# Altium project Buck_Boost.PrjPcb
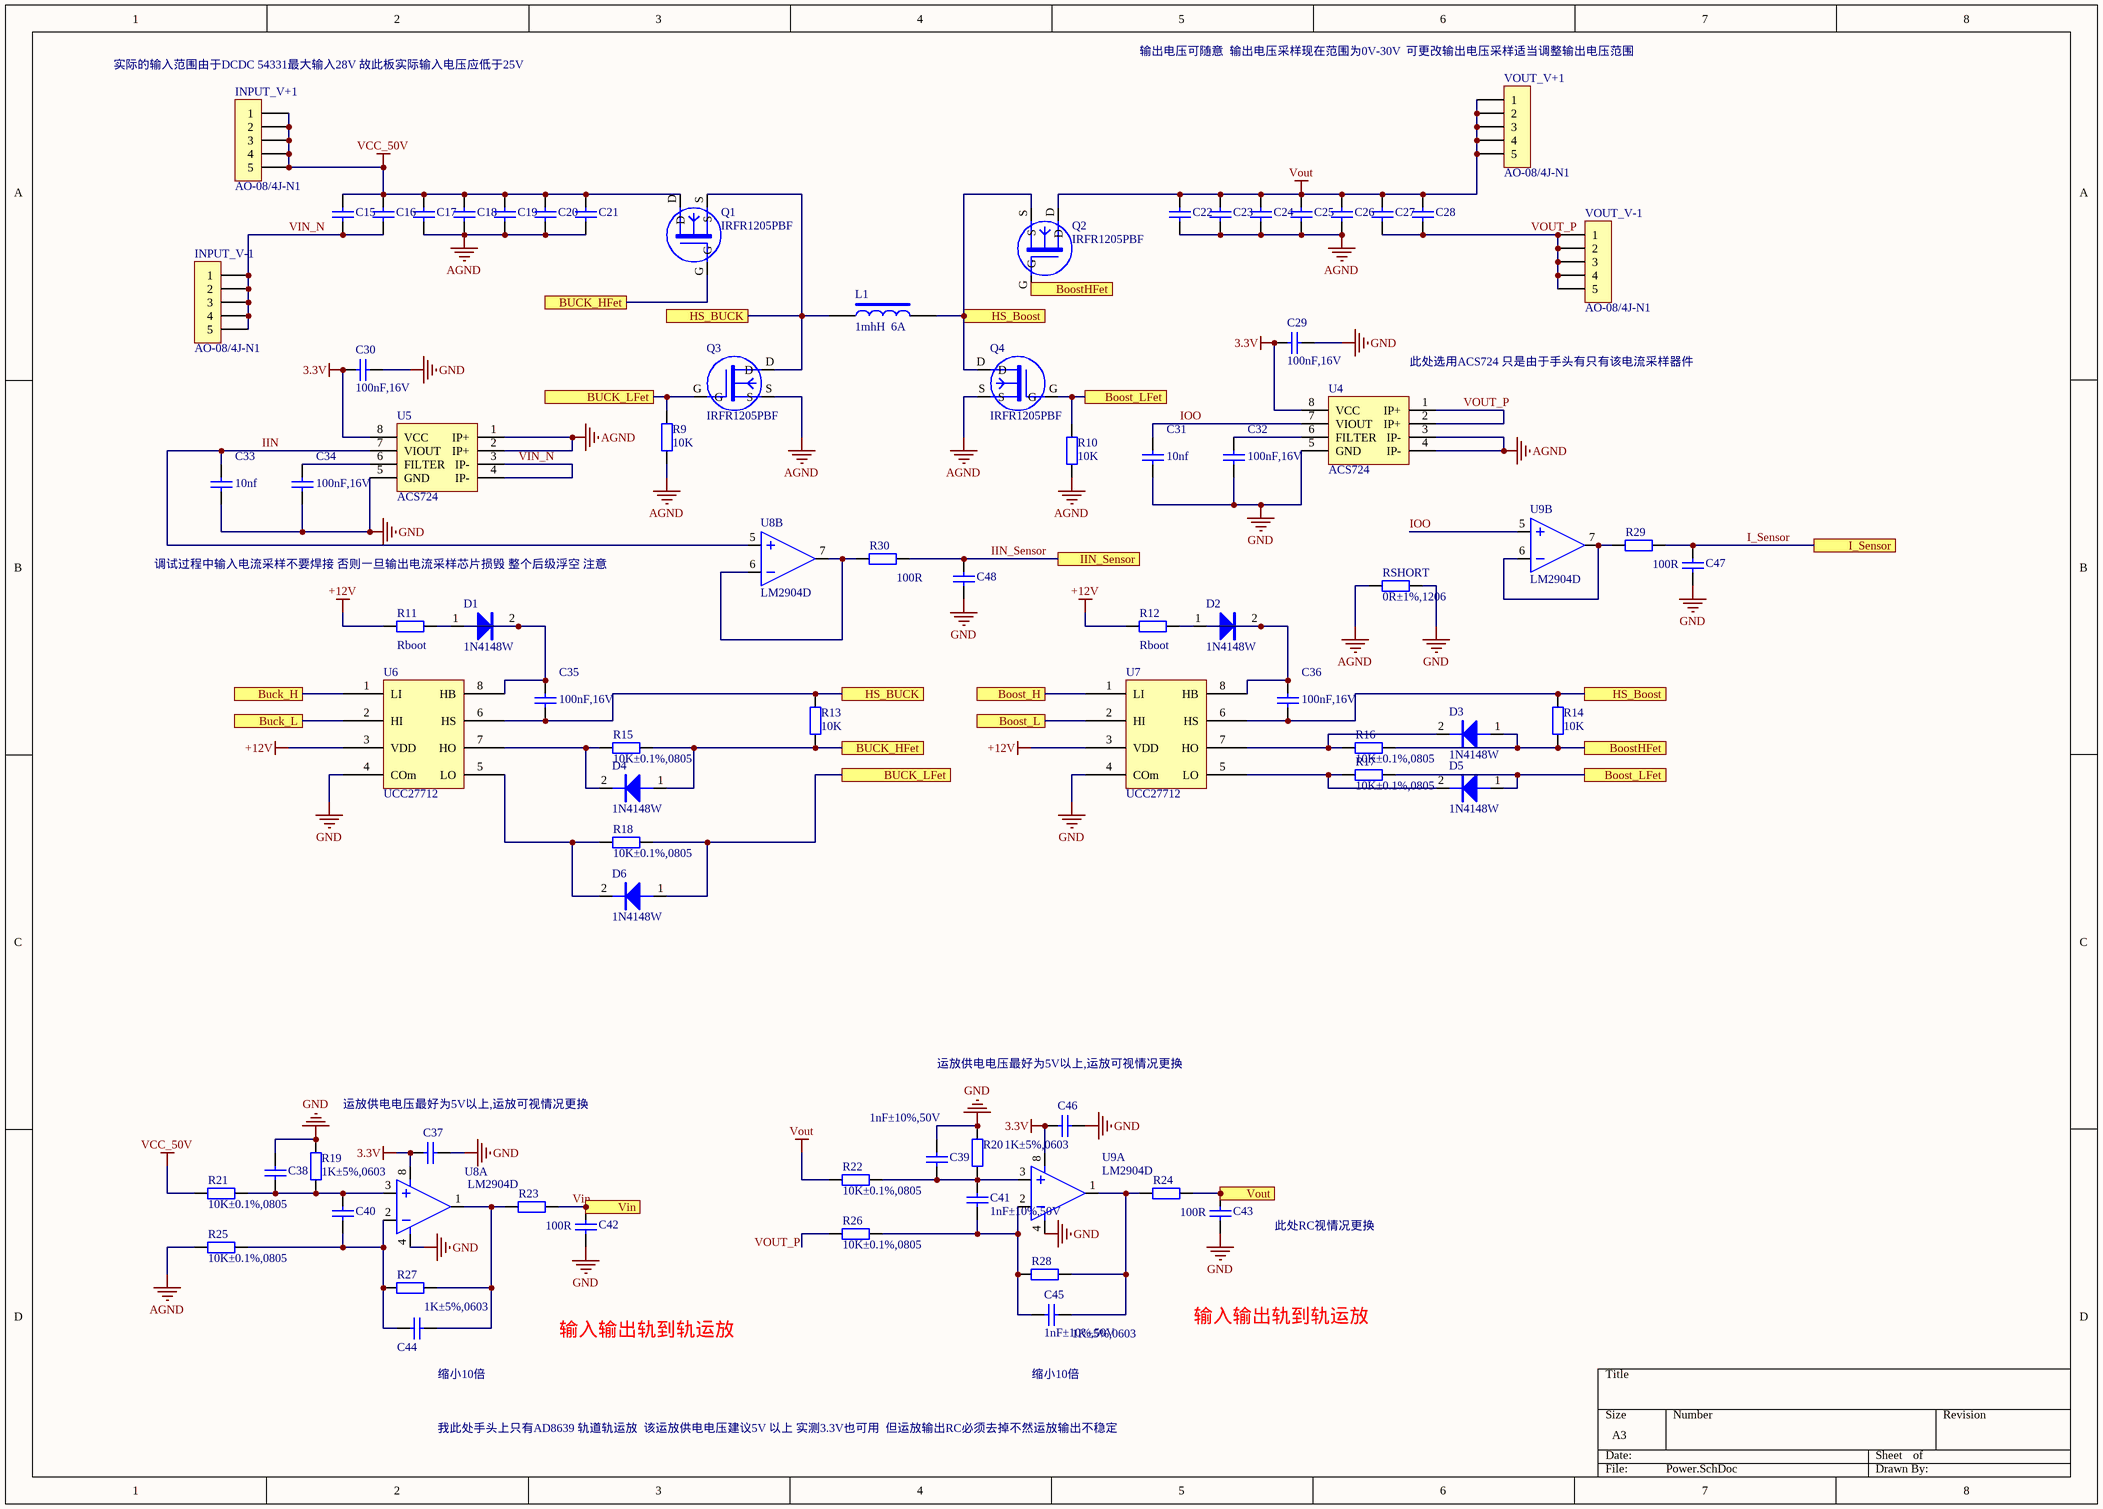
[diagram p0: Power.SchDoc]
3 sheets, 132 parts. Net scope: flat (ports and power ports of the same name join across sheets).
Board file: BuckBoost-1.PcbDoc
Sheets:
  Power.SchDoc
  mcu.SchDoc
  amp.SchDoc

## Sheet Power.SchDoc
size A3

### Parts
C15  4.7uF±10%,50V  [1812]  (value not drawn)
C16  4.7uF±10%,50V  [1812]  (value not drawn)
C17  4.7uF±10%,50V  [1812]  (value not drawn)
C18  4.7uF±10%,50V  [1812]  (value not drawn)
C19  4.7uF±10%,50V  [1812]  (value not drawn)
C20  4.7uF±10%,50V  [1812]  (value not drawn)
C21  4.7uF±10%,50V  [1812]  (value not drawn)
C22  4.7uF±10%,50V  [1812]  (value not drawn)
C23  4.7uF±10%,50V  [1812]  (value not drawn)
C24  4.7uF±10%,50V  [1812]  (value not drawn)
C25  4.7uF±10%,50V  [1812]  (value not drawn)
C26  4.7uF±10%,50V  [1812]  (value not drawn)
C27  4.7uF±10%,50V  [1812]  (value not drawn)
C28  4.7uF±10%,50V  [1812]  (value not drawn)
C29  100nF,16V  [0603]
C30  100nF,16V  [0603]
C31  10nf  [0603]
C32  100nF,16V  [0603]
C33  10nf  [0603]
C34  100nF,16V  [0603]
C35  100nF,16V  [0603]
C36  100nF,16V  [0603]
C37  (no value)  [0603]
C38  (no value)  [0603]
C39  1nF±10%,50V  [0603]
C40  (no value)  [0603]
C41  1nF±10%,50V  [0603]
C42  (no value)  [0603]
C43  (no value)  [0603]
C44  (no value)  [0603]
C45  1nF±10%,50V  [0603]
C46  (no value)  [0603]
C47  (no value)  [0603]
C48  (no value)  [0603]
D1  1N4148W  [SOD-123]
D2  1N4148W  [SOD-123]
D3  1N4148W  [SOD-123]
D4  1N4148W  [SOD-123]
D5  1N4148W  [SOD-123]
D6  1N4148W  [SOD-123]
INPUT_V+1  AO-08/4J-N1  [A076]
INPUT_V-1  AO-08/4J-N1  [A076]
L1  1mhH  6A  [1770-inductor]
Q1  IRFR1205PBF  [TO-252AA]
Q2  IRFR1205PBF  [TO-252AA]
Q3  IRFR1205PBF  [TO-252AA]
Q4  IRFR1205PBF  [TO-252AA]
R9  10K  [0805r]
R10  10K  [0805r]
R11  Rboot  [0805r]
R12  Rboot  [0805r]
R13  10K  [0805R]
R14  10K  [0805r]
R15  10K±0.1%,0805  [0805r]
R16  10K±0.1%,0805  [0805r]
R17  10K±0.1%,0805  [0805r]
R18  10K±0.1%,0805  [0805r]
R19  1K±5%,0603  [0603]
R20  1K±5%,0603  [0603]
R21  10K±0.1%,0805  [0805r]
R22  10K±0.1%,0805  [0805r]
R23  100R  [0603]
R24  100R  [0603]
R25  10K±0.1%,0805  [0805r]
R26  10K±0.1%,0805  [0805r]
R27  1K±5%,0603  [0603]
R28  1K±5%,0603  [0603]
R29  100R  [0603]
R30  100R  [0603]
RSHORT  0R±1%,1206  [1206]
U4  ACS724  [SOIC-8]
U5  ACS724  [SOIC-8]
U6  UCC27712  [SOIC-8]
U7  UCC27712  [SOIC-8]
U8  LM2904D  [SO-8]  (parts A,B of 2)
U9  LM2904D  [SO-8]  (parts A,B of 2)
VOUT_V+1  AO-08/4J-N1  [A076]
VOUT_V-1  AO-08/4J-N1  [A076]

### Ports
Boost_H, Boost_L, Boost_LFet, BoostHFet, Buck_H, BUCK_HFet, Buck_L, BUCK_LFet, HS_Boost, HS_BUCK, I_Sensor, IIN_Sensor, Vin, Vout

### Nets
3.3V: C29.2 C30.2 C37.2 C46.2 U4.8(VCC) U5.8(VCC) U8.8 U9.8
+12V: R11.1 R12.1 U6.3(VDD) U7.3(VDD)
AGND: C17.1 C18.1 C19.1 C20.1 C21.1 C22.1 C23.1 C24.1 C25.1 C26.1 Q3.S Q4.S R9.1 R10.1 R25.1 RSHORT.1 U4.3(IP-) U4.4(IP-) U5.1(IP+) U5.2(IP+)
GND: C29.1 C30.1 C31.1 C32.1 C33.1 C34.1 C37.1 C38.2 C39.2 C42.2 C43.2 C46.1 C47.2 C48.2 R19.2 R20.2 RSHORT.2 U4.5(GND) U5.5(GND) U6.4(COm) U7.4(COm) U8.4 U9.4
VCC_50V: C15.2 C16.2 C17.2 C18.2 C19.2 C20.2 C21.2 INPUT_V+1.1 INPUT_V+1.2 INPUT_V+1.3 INPUT_V+1.4 INPUT_V+1.5 Q1.D R21.1
Vout: C22.2 C23.2 C24.2 C25.2 C26.2 C27.2 C28.2 Q2.D R22.1 VOUT_V+1.1 VOUT_V+1.2 VOUT_V+1.3 VOUT_V+1.4 VOUT_V+1.5
HRTIM1_CHA1: U7.1(LI) ; port Boost_H
HRTIM1_CHA2: U7.2(HI) ; port Boost_L
HRTIM1_CHB1: U6.1(LI) ; port Buck_H
HRTIM1_CHB2: U6.2(HI) ; port Buck_L
I_Sensor: C47.1 R29.1 ; port I_Sensor
IIN: C33.2 U5.7(VIOUT) U8.5
IIN_Sensor: C48.1 R30.1 ; port IIN_Sensor
IOO: C31.2 U4.7(VIOUT) U9.5
Vin: C42.1 R23.1 ; port Vin
VIN_N: C15.1 C16.1 INPUT_V-1.1 INPUT_V-1.2 INPUT_V-1.3 INPUT_V-1.4 INPUT_V-1.5 U5.3(IP-) U5.4(IP-)
Vout: C43.1 R24.1 ; port Vout  [a separate net that carries the same name]
VOUT_P: C27.1 C28.1 R26.1 U4.1(IP+) U4.2(IP+) VOUT_V-1.1 VOUT_V-1.2 VOUT_V-1.3 VOUT_V-1.4 VOUT_V-1.5
NetC32_2: C32.2 U4.6(FILTER)
NetC34_2: C34.2 U5.6(FILTER)
NetC35_1: C35.1 L1.1 Q1.S Q3.D R13.2 U6.6(HS) ; port HS_BUCK
NetC35_2: C35.2 D1.2(K) U6.8(HB)
NetC36_1: C36.1 L1.2 Q2.S Q4.D R14.2 U7.6(HS) ; port HS_Boost
NetC36_2: C36.2 D2.2(K) U7.8(HB)
NetC38_1: C38.1 C40.2 R19.1 R21.2 U8.3
NetC39_1: C39.1 C41.2 R20.1 R22.2 U9.3
NetC40_1: C40.1 C44.2 R25.2 R27.2 U8.2
NetC41_1: C41.1 C45.2 R26.2 R28.2 U9.2
NetC44_1: C44.1 R23.2 R27.1 U8.1
NetC45_1: C45.1 R24.2 R28.1 U9.1
NetD1_1: D1.1(A) R11.2
NetD2_1: D2.1(A) R12.2
NetD3_1: D3.1(A) Q2.G R14.1 R16.2 ; port BoostHFet
NetD3_2: D3.2(K) R16.1 U7.7(HO)
NetD4_1: D4.1(A) Q1.G R13.1 R15.2 ; port BUCK_HFet
NetD4_2: D4.2(K) R15.1 U6.7(HO)
NetD5_1: D5.1(A) Q4.G R10.2 R17.2 ; port Boost_LFet
NetD5_2: D5.2(K) R17.1 U7.5(LO)
NetD6_1: D6.1(A) Q3.G R9.2 R18.2 ; port BUCK_LFet
NetD6_2: D6.2(K) R18.1 U6.5(LO)
NetR29_2: R29.2 U9.6 U9.7
NetR30_2: R30.2 U8.6 U8.7

### Notes on the sheet
- (near INPUT_V+1) 实际的输入范围由于DCDC 54331最大输入28V 故此板实际输入电压应低于25V
- 输出电压可随意  输出电压采样现在范围为0V-30V  可更改输出电压采样适当调整输出电压范围
- (near U4) 此处选用ACS724 只是由于手头有只有该电流采样器件
- 调试过程中输入电流采样不要焊接 否则一旦输出电流采样芯片损毁 整个后级浮空 注意
- 运放供电电压最好为5V以上,运放可视情况更换
- 此处RC视情况更换
- 输入输出轨到轨运放
- (near C44) 缩小10倍
- 缩小10倍
- 我此处手头上只有AD8639 轨道轨运放  该运放供电电压建议5V 以上 实测3.3V也可用  但运放输出RC必须去掉不然运放输出不稳定

### Library data of the parts
C15-C28 = 贴片电容,1812,4.7uF±10%,50V,X7R系列,TDK: 贴片电容; 物料代码: 1.02.15.0047506000
C29-C36 = 贴片电容,0603,100nF,16V: 贴片电容; 物料代码: 1.02.15.0010402010
C37 C38 C40 C42-C44 C46-C48 = 贴片电容,0603,100nF±10%,50V: 贴片电容; 物料代码: 1.02.15.0010406040
C39 C41 C45 = 贴片电容,0603,1nF±10%,50V: 贴片电容; 物料代码: 1.02.15.0010206030
D1-D6 = 整流二极管,1N4148W,100V,150mA,SOD-123: 整流二极管; 物料代码: 1.03.01.0414800020
INPUT_V+1 INPUT_V-1 VOUT_V+1 VOUT_V-1 = AO-08/4J-N1，7.8X7.8mm,DIP-4,M3螺纹孔,中心距5X7mm,表面镀锡: PCB接线端子; 物料代码: 1.06.99.2608410000
L1 = 1mH,800mA,0810: 贴片电感; 物料代码: 1.05.01.0100000000
Q1-Q4 = MOSFET功率管,IRFR1205PBF,55V,44A,27mR,NPN,TO-252AA: MOSFET功率管; 物料代码: 1.03.07.1120500000
R9-R14 = 4.7R±1%,MEF0207,0.5W,25PPM,品牌:EBG: 圆柱形精密贴片电阻; 物料代码: 1.01.11.0478250000
R15-R18 R21 R22 R25 R26 = 10K±0.1%,1/8w,0805: 贴片电阻; 物料代码: 1.01.11.1002020020
R19 R20 R23 R24 R27-R30 = 10K±5%,1/10W,0603: 贴片电阻; 物料代码: 1.01.11.0103010000
RSHORT = 0R±5%,1/4W,1206: 贴片电阻; 物料代码: 1.01.11.0000030000
U4 U5 = ACS724: 电流传感器; 物料代码: 1.04.01.0725200000
U8 U9 = 运算放大器,LM2904D,SO-8: 运算放大器; 物料代码: 1.04.07.0290400000

## Sheet mcu.SchDoc
size A4
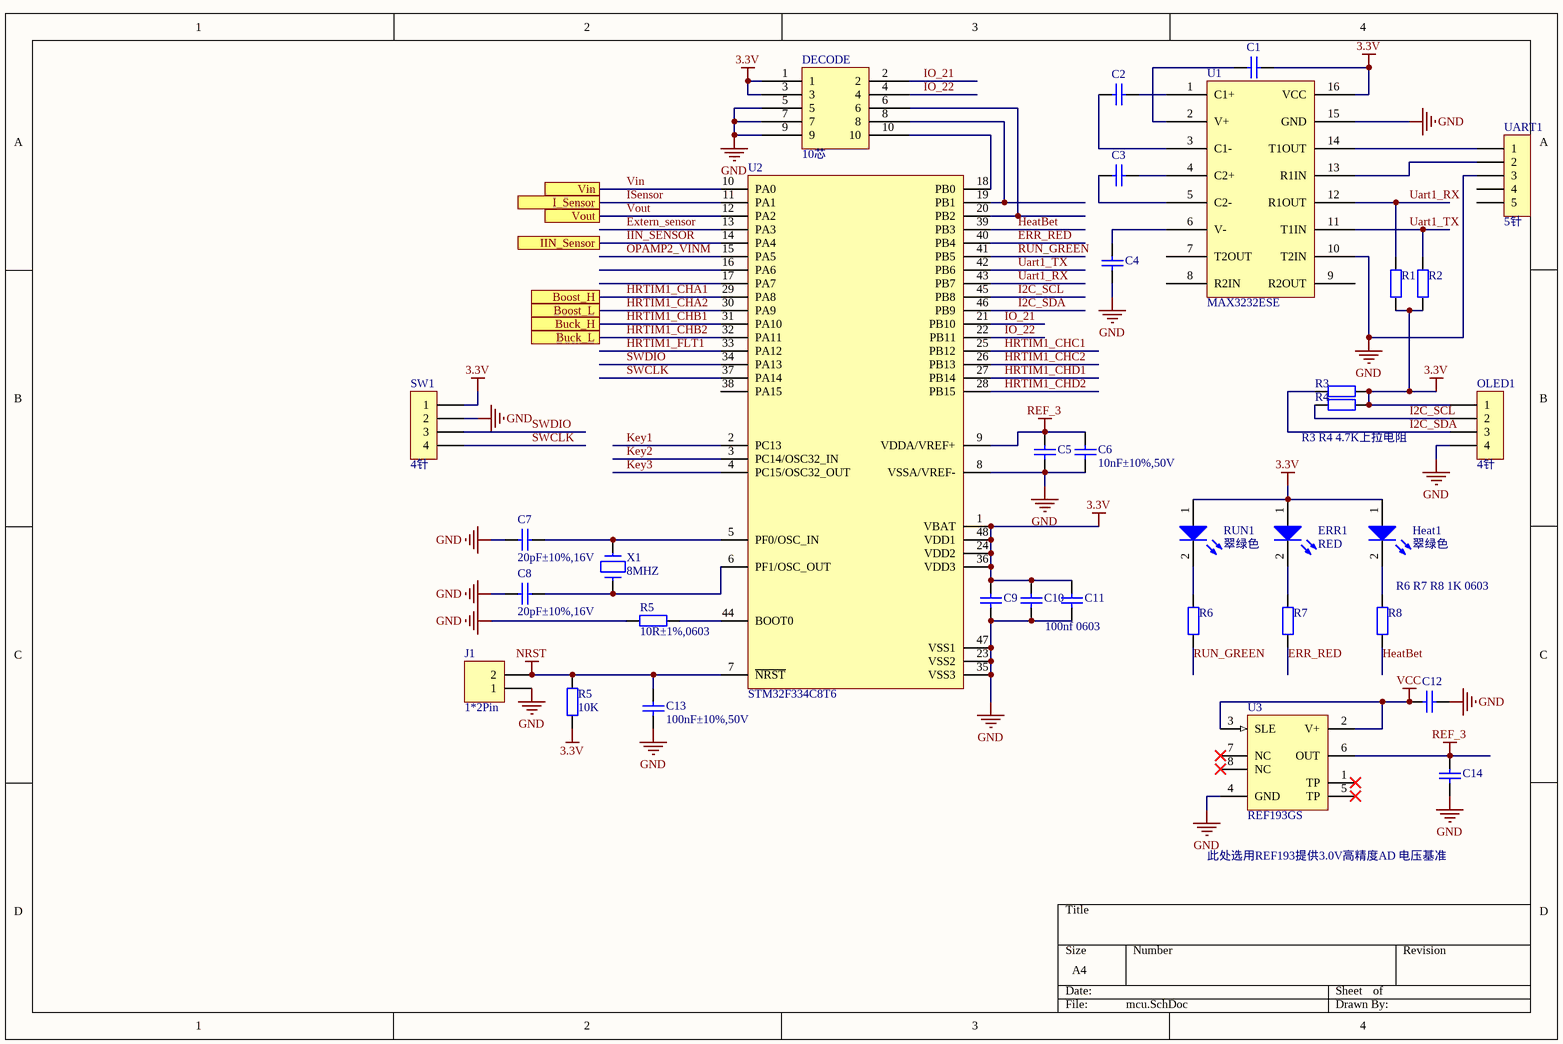
[diagram p1: mcu.SchDoc]

### Parts
(Parts that share a designator on the sheet are numbered #1, #2 ... from top to bottom, then left to right.)
C1  (no value)  [0603]
C2  (no value)  [0603]
C3  (no value)  [0603]
C4  (no value)  [0603]
C5  (no value)  [0603]
C6  10nF±10%,50V  [0603]
C7  20pF±10%,16V  [0603]
C8  20pF±10%,16V  [0603]
C9  (no value)  [0603]
C10  (no value)  [0603]
C11  (no value)  [0603]
C12  (no value)  [0603]
C13  100nF±10%,50V  [0603]
C14  (no value)  [0603]
DECODE  10芯  [IDC-10]
ERR1  RED  [0805LED]
Heat1  翠绿色  [0805LED]
J1  1*2Pin  [HDR1X2]
OLED1  4针  [SIP-4]
R1  (no value)  [0603]
R2  (no value)  [0603]
R3  (no value)  [0603]
R4  (no value)  [0603]
R5#1  10R±1%,0603  [0603]
R5#2  10K  [0603]
R6  (no value)  [0603]
R7  (no value)  [0603]
R8  (no value)  [0603]
RUN1  翠绿色  [0805LED]
SW1  4针  [SIP-4]
U1  MAX3232ESE  [SOP-16]
U2  STM32F334C8T6  [LQFP48_L]
U3  REF193GS  [SO-8]
UART1  5针  [SIP-5-2]
X1  8MHZ  [5032]

### Ports
Boost_H, Boost_L, Buck_H, Buck_L, I_Sensor, IIN_Sensor, Vin, Vout

### Nets
3.3V: C1.1 C9.2 C10.2 C11.2 DECODE.1 DECODE.3 ERR1.1(A) Heat1.1(A) OLED1.1 R1.2 R2.2 R3.1 R4.2 R5#2.1 RUN1.1(A) SW1.1 U1.16(VCC) U2.1(VBAT) U2.24(VDD2) U2.36(VDD3) U2.48(VDD1)
GND: C4.2 C5.1 C6.1 C7.1 C8.1 C9.1 C10.1 C11.1 C12.1 C13.1 C14.1 DECODE.5 DECODE.7 DECODE.9 J1.1 OLED1.4 R5#1.1 SW1.2 U1.10(T2IN) U1.15(GND) U2.8(VSSA/VREF-) U2.23(VSS2) U2.35(VSS3) U2.47(VSS1) U3.4(GND) UART1.3
NRST: C13.2 J1.2 R5#2.2 U2.7(~{NRST})
REF_3: C5.2 C6.2 C14.2 U2.9(VDDA/VREF+) U3.6(OUT)
VCC: C12.2 U3.2(V+) U3.3(SLE)
ERR_RED: R7.1 U2.40(PB4)
Extern_sensor: U2.13(PA3)
HeatBet: R8.1 U2.39(PB3)
HRTIM1_CHA1: U2.29(PA8) ; port Boost_H
HRTIM1_CHA2: U2.30(PA9) ; port Boost_L
HRTIM1_CHB1: U2.31(PA10) ; port Buck_H
HRTIM1_CHB2: U2.32(PA11) ; port Buck_L
HRTIM1_CHC1: U2.25(PB12)
HRTIM1_CHC2: U2.26(PB13)
HRTIM1_CHD1: U2.27(PB14)
HRTIM1_CHD2: U2.28(PB15)
HRTIM1_FLT1: U2.33(PA12)
I2C_SCL: OLED1.2 R4.1 U2.45(PB8)
I2C_SDA: OLED1.3 R3.2 U2.46(PB9)
IIN_Sensor: U2.14(PA4) ; port IIN_Sensor
IO_21: DECODE.2 U2.21(PB10)
IO_22: DECODE.4 U2.22(PB11)
ISensor: U2.11(PA1) ; port I_Sensor  [project net I_Sensor]
Key1: U2.2(PC13)
Key2: U2.3(PC14/OSC32_IN)
Key3: U2.4(PC15/OSC32_OUT)
OPAMP2_VINM: U2.15(PA5)
RUN_GREEN: R6.1 U2.41(PB5)
SWCLK: SW1.4 U2.37(PA14)
SWDIO: SW1.3 U2.34(PA13)
Uart1_RX: R1.1 U1.12(R1OUT) U2.43(PB7)
Uart1_TX: R2.1 U1.11(T1IN) U2.42(PB6)
Vin: U2.10(PA0) ; port Vin
Vout: U2.12(PA2) ; port Vout
NetC1_2: C1.2 U1.2(V+)
NetC2_1: C2.1 U1.1(C1+)
NetC2_2: C2.2 U1.3(C1-)
NetC3_1: C3.1 U1.4(C2+)
NetC3_2: C3.2 U1.5(C2-)
NetC4_1: C4.1 U1.6(V-)
NetC7_2: C7.2 U2.5(PF0/OSC_IN) X1.1
NetC8_2: C8.2 U2.6(PF1/OSC_OUT) X1.2
NetDECODE_6: DECODE.6 U2.20(PB2)
NetDECODE_8: DECODE.8 U2.19(PB1)
NetDECODE_10: DECODE.10 U2.18(PB0)
NetERR1_2: ERR1.2(K) R7.2
NetHeat1_2: Heat1.2(K) R8.2
NetR5#1_2: R5#1.2 U2.44(BOOT0)
NetR6_2: R6.2 RUN1.2(K)
NetU1_13: U1.13(R1IN) UART1.2
NetU1_14: U1.14(T1OUT) UART1.1

Not connected (* = marked no-connect by the designer): U1 7(T2OUT) 8(R2IN) 9(R2OUT); U2 16(PA6) 17(PA7) 38(PA15); U3 1(TP)* 5(TP)* 7(NC)* 8(NC)*; UART1 4 5

### Notes on the sheet
- R3 R4 4.7K上拉电阻
- (near R8) R6 R7 R8 1K 0603
- 100nf 0603
- 此处选用REF193提供3.0V高精度AD 电压基准

### Library data of the parts
C1-C5 C9-C14 = 贴片电容,0603,100nF±10%,50V: 贴片电容; 物料代码: 1.02.15.0010406040
C6 = 贴片电容,0603,10nF±10%,50V: 贴片电容; 物料代码: 1.02.15.0010306020
C7 C8 = 贴片电容,0603,20pF±10%,16V: 贴片电容; 物料代码: 1.02.15.0020002000
DECODE = 双列排针母座,10芯,2.54mm: 双列排针母座; 物料代码: 1.06.99.2610000040
ERR1 Heat1 RUN1 = 发光二极管,翠绿色,JLF-0805-1-GC,0805: 发光二极管; 物料代码: 1.03.04.0080510000
J1 = 单列直脚排针,2芯,2.54mm,HDR1X2: 单列直脚排针; 物料代码: 1.06.99.2620000000
OLED1 SW1 = 条形连接器,PH(2.0),4针直针,间距2.00mm,SIP-4: 条形连接器; 物料代码: 1.06.99.2200000010
R1-R4 R5#1 R5#2 R6-R8 = 10R±1%,1/10W,0603: 贴片电阻; 物料代码: 1.01.11.0100010000
U1 = RS232收发器,MAX3232ESE，SOP-16: RS232收发器; 物料代码: 1.04.06.0323200010
U2 = STM32F334Cx
U3 = 电源基准芯片,REF193GS,3V,±10mV,SO-8: 电源基准芯片; 物料代码: 1.04.11.0193000000
UART1 = 条形连接器,PH(2.0),5针直针,间距2.00mm,SIP-5-2: 条形连接器; 物料代码: 1.06.99.2220500000
X1 = XTAL_SMD

## Sheet amp.SchDoc
size A4
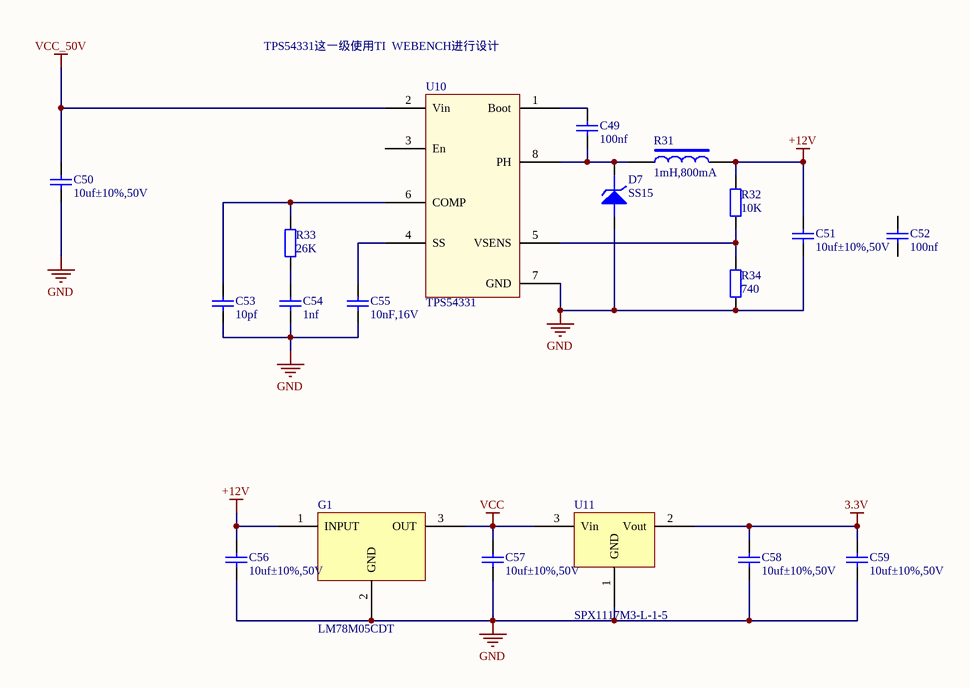
[diagram p2: amp.SchDoc]

### Parts
C49  100nf  [0603]
C50  10uf±10%,50V  [1206]
C51  10uf±10%,50V  [1206]
C52  100nf  [0603]
C53  10pf  [0603]
C54  1nf  [0603]
C55  10nF,16V  [0603]
C56  10uf±10%,50V  [1206]
C57  10uf±10%,50V  [1206]
C58  10uf±10%,50V  [1206]
C59  10uf±10%,50V  [1206]
D7  SS15  [SMA]
G1  LM78M05CDT  [TO-252]
R31  1mH,800mA  [0603_induct]
R32  10K  [0603]
R33  26K  [0603]
R34  740  [0603]
U10  TPS54331  [SOIC-8]
U11  SPX1117M3-L-1-5  [SOT-223]

### Nets
3.3V: C58.2 C59.2 U11.2(Vout)
+12V: C51.2 C56.2 G1.1(INPUT) R31.2 R32.2
GND: C50.1 C51.1 C53.1 C54.1 C55.1 C56.1 C57.1 C58.1 C59.1 D7.1(A) G1.2(GND) R34.1 U10.7(GND) U11.1(GND)
VCC: C57.2 G1.3(OUT) U11.3(Vin)
VCC_50V: C50.2 U10.2(Vin)
NetC49_1: C49.1 D7.2(K) R31.1 U10.8(PH)
NetC49_2: C49.2 U10.1(Boot)
NetC53_2: C53.2 R33.2 U10.6(COMP)
NetC54_2: C54.2 R33.1
NetC55_2: C55.2 U10.4(SS)
NetR32_1: R32.1 R34.2 U10.5(VSENS)

Not connected (* = marked no-connect by the designer): C52 1 2; U10 3(En)

### Notes on the sheet
- TPS54331这一级使用TI  WEBENCH进行设计

### Library data of the parts
C49 C52-C55 = 贴片电容,0603,10nF±10%,16V: 贴片电容; 物料代码: 1.02.15.0010302000
C50 C51 C56-C59 = 贴片电容,1206,10uf±10%,50V: 贴片电容; 物料代码: 1.02.15.0010606010
D7 = 肖特基二极管,SS15,50V,1A,SMA: 肖特基二极管; 物料代码: 1.03.01.0150000000
G1 = 电压转换器,LM78M05CDT,TO-252: 电压转换器; 物料代码: 1.04.08.0780500000
R31 = 1mH,800mA,0810: 贴片电感; 物料代码: 1.05.01.0100000000
R32-R34 = 6.2K±1%,1/10W,0603: 贴片电阻; 物料代码: 1.01.11.6201010000
U10 = TPS54331-sop8
U11 = 电压转换器,SPX1117M3-L-1-5,SOT-223,环保: 电压转换器; 物料代码: 1.04.11.0111731011

## Nets that join several sheets
3.3V: Power (8 pins), mcu (21 pins), amp (C58.2 C59.2 U11.2)
+12V: Power (R11.1 R12.1 U6.3 U7.3), amp (5 pins)
GND: Power (23 pins), mcu (26 pins), amp (14 pins)
VCC: mcu (C12.2 U3.2 U3.3), amp (C57.2 G1.3 U11.3)
VCC_50V: Power (14 pins), amp (C50.2 U10.2)
HRTIM1_CHA1: Power (U7.1), mcu (U2.29)
HRTIM1_CHA2: Power (U7.2), mcu (U2.30)
HRTIM1_CHB1: Power (U6.1), mcu (U2.31)
HRTIM1_CHB2: Power (U6.2), mcu (U2.32)
I_Sensor: Power (C47.1 R29.1), mcu (U2.11)
IIN_Sensor: Power (C48.1 R30.1), mcu (U2.14)
Vin: Power (C42.1 R23.1), mcu (U2.10)
Vout: Power (C43.1 R24.1), mcu (U2.12)